# Altium project bt1.PrjPcb
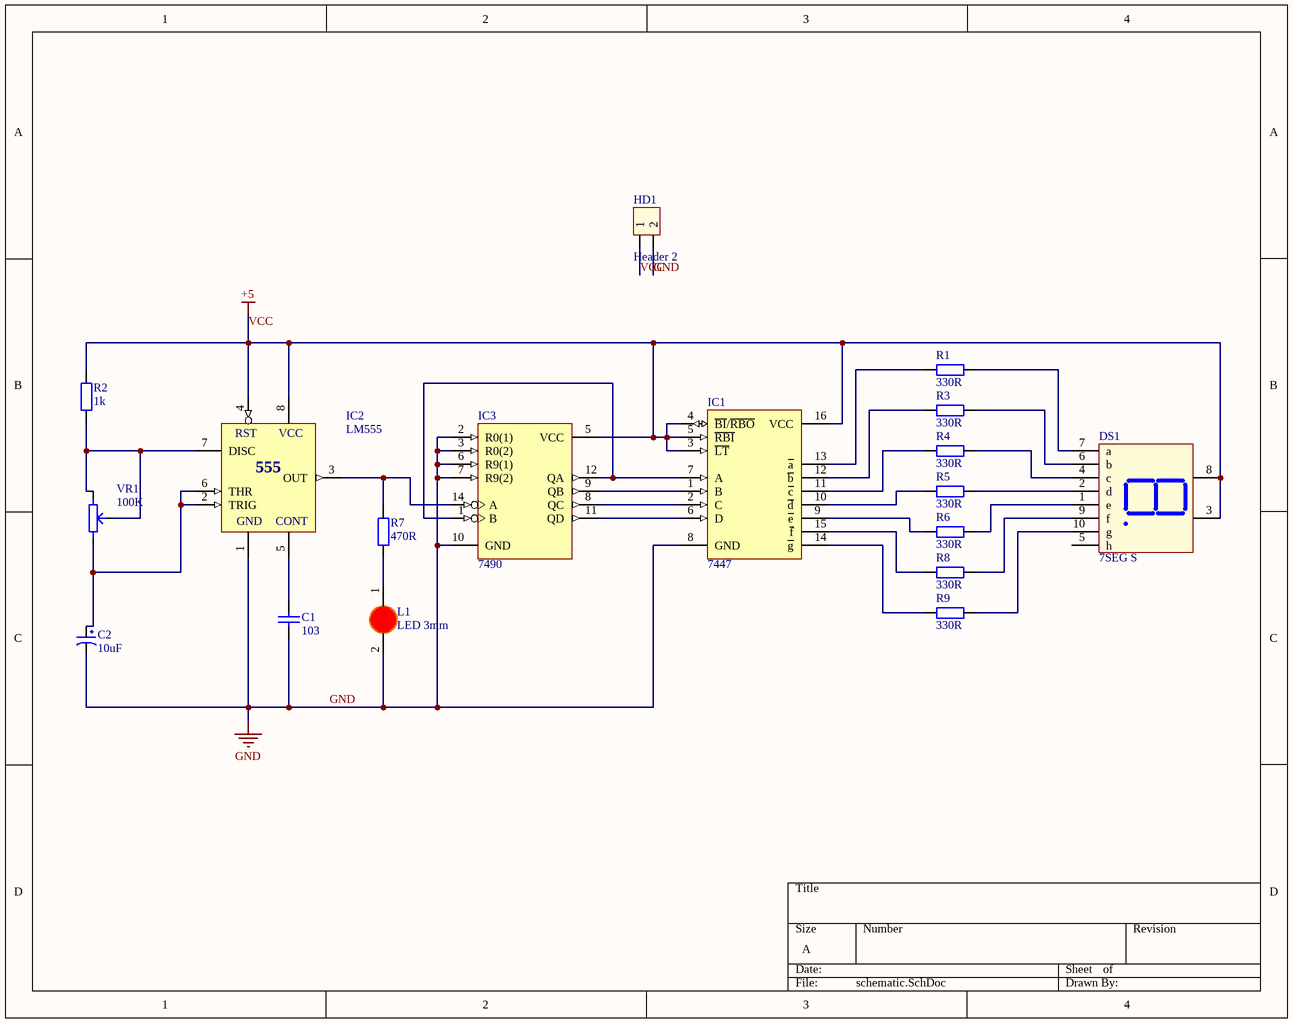
[diagram p0: schematic.SchDoc]
1 sheet, 18 parts. Net scope: global (net labels, ports and power ports of the same name join across sheets).
Board file: PCB.PcbDoc

## Sheet schematic.SchDoc
size A; SheetNumber: 1; SheetTotal: 1

### Parts
C1  103  [tu gom]
C2  10uF  [tu hoa 13mm]
DS1  7SEG S  [7SEGS]
HD1  Header 2  [HED2]
IC1  7447  [DIP16/W0.3]
IC2  LM555  [DIP8/W0.3]
IC3  7490  [DIP14/W0.3]
L1  LED 3mm  [LED-3MM-RED]
R1  330R  [tro vach 1/4w]
R2  1k  [tro vach 1/4w]
R3  330R  [tro vach 1/4w]
R4  330R  [tro vach 1/4w]
R5  330R  [tro vach 1/4w]
R6  330R  [tro vach 1/4w]
R7  470R  [tro vach 1/4w]
R8  330R  [tro vach 1/4w]
R9  330R  [tro vach 1/4w]
VR1  100K  [Bien Tro Tam Giac Dung]

### Nets
GND: C1.2 C2.2 HD1.2 IC1.8(GND) IC2.1(GND) IC3.2(R0(1)) IC3.3(R0(2)) IC3.6(R9(1)) IC3.7(R9(2)) IC3.10(GND) L1.2(K)
VCC: DS1.3(Vcc) DS1.8(Vcc) HD1.1 IC1.3(~{LT}) IC1.4(~{BI}/~{RBO}) IC1.5(~{RBI}) IC1.16(VCC) IC2.4(RST) IC2.8(VCC) IC3.5(VCC) R2.2  [also labelled +5]
NetC1_1: C1.1 IC2.5(CONT)
NetC2_1: C2.1 IC2.2(TRIG) IC2.6(THR) VR1.3
NetDS1_1: DS1.1(e) R6.2
NetDS1_2: DS1.2(d) R5.2
NetDS1_4: DS1.4(c) R4.2
NetDS1_6: DS1.6(b) R3.2
NetDS1_7: DS1.7(a) R1.2
NetDS1_9: DS1.9(f) R8.2
NetDS1_10: DS1.10(g) R9.2
NetIC1_1: IC1.1(B) IC3.9(QB)
NetIC1_2: IC1.2(C) IC3.8(QC)
NetIC1_6: IC1.6(D) IC3.11(QD)
NetIC1_7: IC1.7(A) IC3.1(B) IC3.12(QA)
NetIC1_9: IC1.9(~{e}) R6.1
NetIC1_10: IC1.10(~{d}) R5.1
NetIC1_11: IC1.11(~{c}) R4.1
NetIC1_12: IC1.12(~{b}) R3.1
NetIC1_13: IC1.13(~{a}) R1.1
NetIC1_14: IC1.14(~{g}) R9.1
NetIC1_15: IC1.15(~{f}) R8.1
NetIC2_3: IC2.3(OUT) IC3.14(A) R7.2
NetIC2_7: IC2.7(DISC) R2.1 VR1.1 VR1.2
NetL1_1: L1.1(A) R7.1

Not connected (* = marked no-connect by the designer): DS1 5(h)

### Notes on the sheet
- (in symbol LM555) 555

### Library data of the parts
C1 = Tu gom 103 50V: Cắm; So_Chan: 2; Ten_Linh_Kien: Tụ gốm 103 10nF 50V; Don_Vi: Con; Ma_Hang: MH000936; Chung_Loai: Cắm; Kieu_Chan: *
C2 = Tu Hoa 10uF 450V 13x20: Cắm; Don_Vi: Con; So_Chan: 2; Ten_Linh_Kien: Tụ Hóa 10uF 450V 13x20MM; Ma_Hang: MH003950; Chung_Loai: Cắm; Kieu_Chan: *
DS1 = LED7S: Single 7 Seg Dipslay; Value: LED 7S SEG
HD1 = Hed2: Header 2 (Green); Value: Header 2
IC1 = 7447: BCD to 7-Segment Decoder/Driver; Value: 7447 , 74247
IC2 = LM555: Timer; Value: LM555
IC3 = 7490: 4-Bit Decade Counter; Value: 7490
L1 = LED 3mm Do: Cắm; Don_Vi: Con; Ma_Hang: MH003892; Ten_Linh_Kien: Led 3MM Phủ Đỏ (10c); Ghi_Chu: *; Kieu_Chan: *; Chung_Loai: Cắm
R1 R3-R6 R8 R9 = Tro Vach 1/4W 1% 330R: Cắm; Don_Vi: Con; So_Chan: 2; Ten_Linh_Kien: Trở Vạch 1/4w 1% 330R; Ma_Hang: MH006348; Chung_Loai: Cắm; Kieu_Chan: *
R2 = Tro Vach 1/4W 5% 1k: Cắm; Don_Vi: Con; So_Chan: 2; Ten_Linh_Kien: Trở Vạch 1/4w 5% 1k; Ma_Hang: MH007390; Chung_Loai: Cắm; Kieu_Chan: *
R7 = Tro Vach 1/4W 5% 470R: Cắm; Don_Vi: Con; So_Chan: 2; Ten_Linh_Kien: Trở Vạch 1/4w 5% 470R; Ma_Hang: MH007320; Chung_Loai: Cắm; Kieu_Chan: *
VR1 = Bien tro tam giac 100K Dung: Cắm; Don_Vi: Con; Ten_Linh_Kien: Biến Trở Tam Giác 104-100K RM065; Ma_Hang: MH003711; Chung_Loai: Cắm; Ghi_Chu: *; Kieu_Chan: *